# Altium schematic sheet pca63100_power_supply.SchDoc: Power Profiler Kit II
size A3; Organization: Nordic Semiconductor; Revision: 1.0.1; SheetNumber: 3; SheetTotal: 6; CompanyName: Nordic Semiconductor; DocumentSize: A3
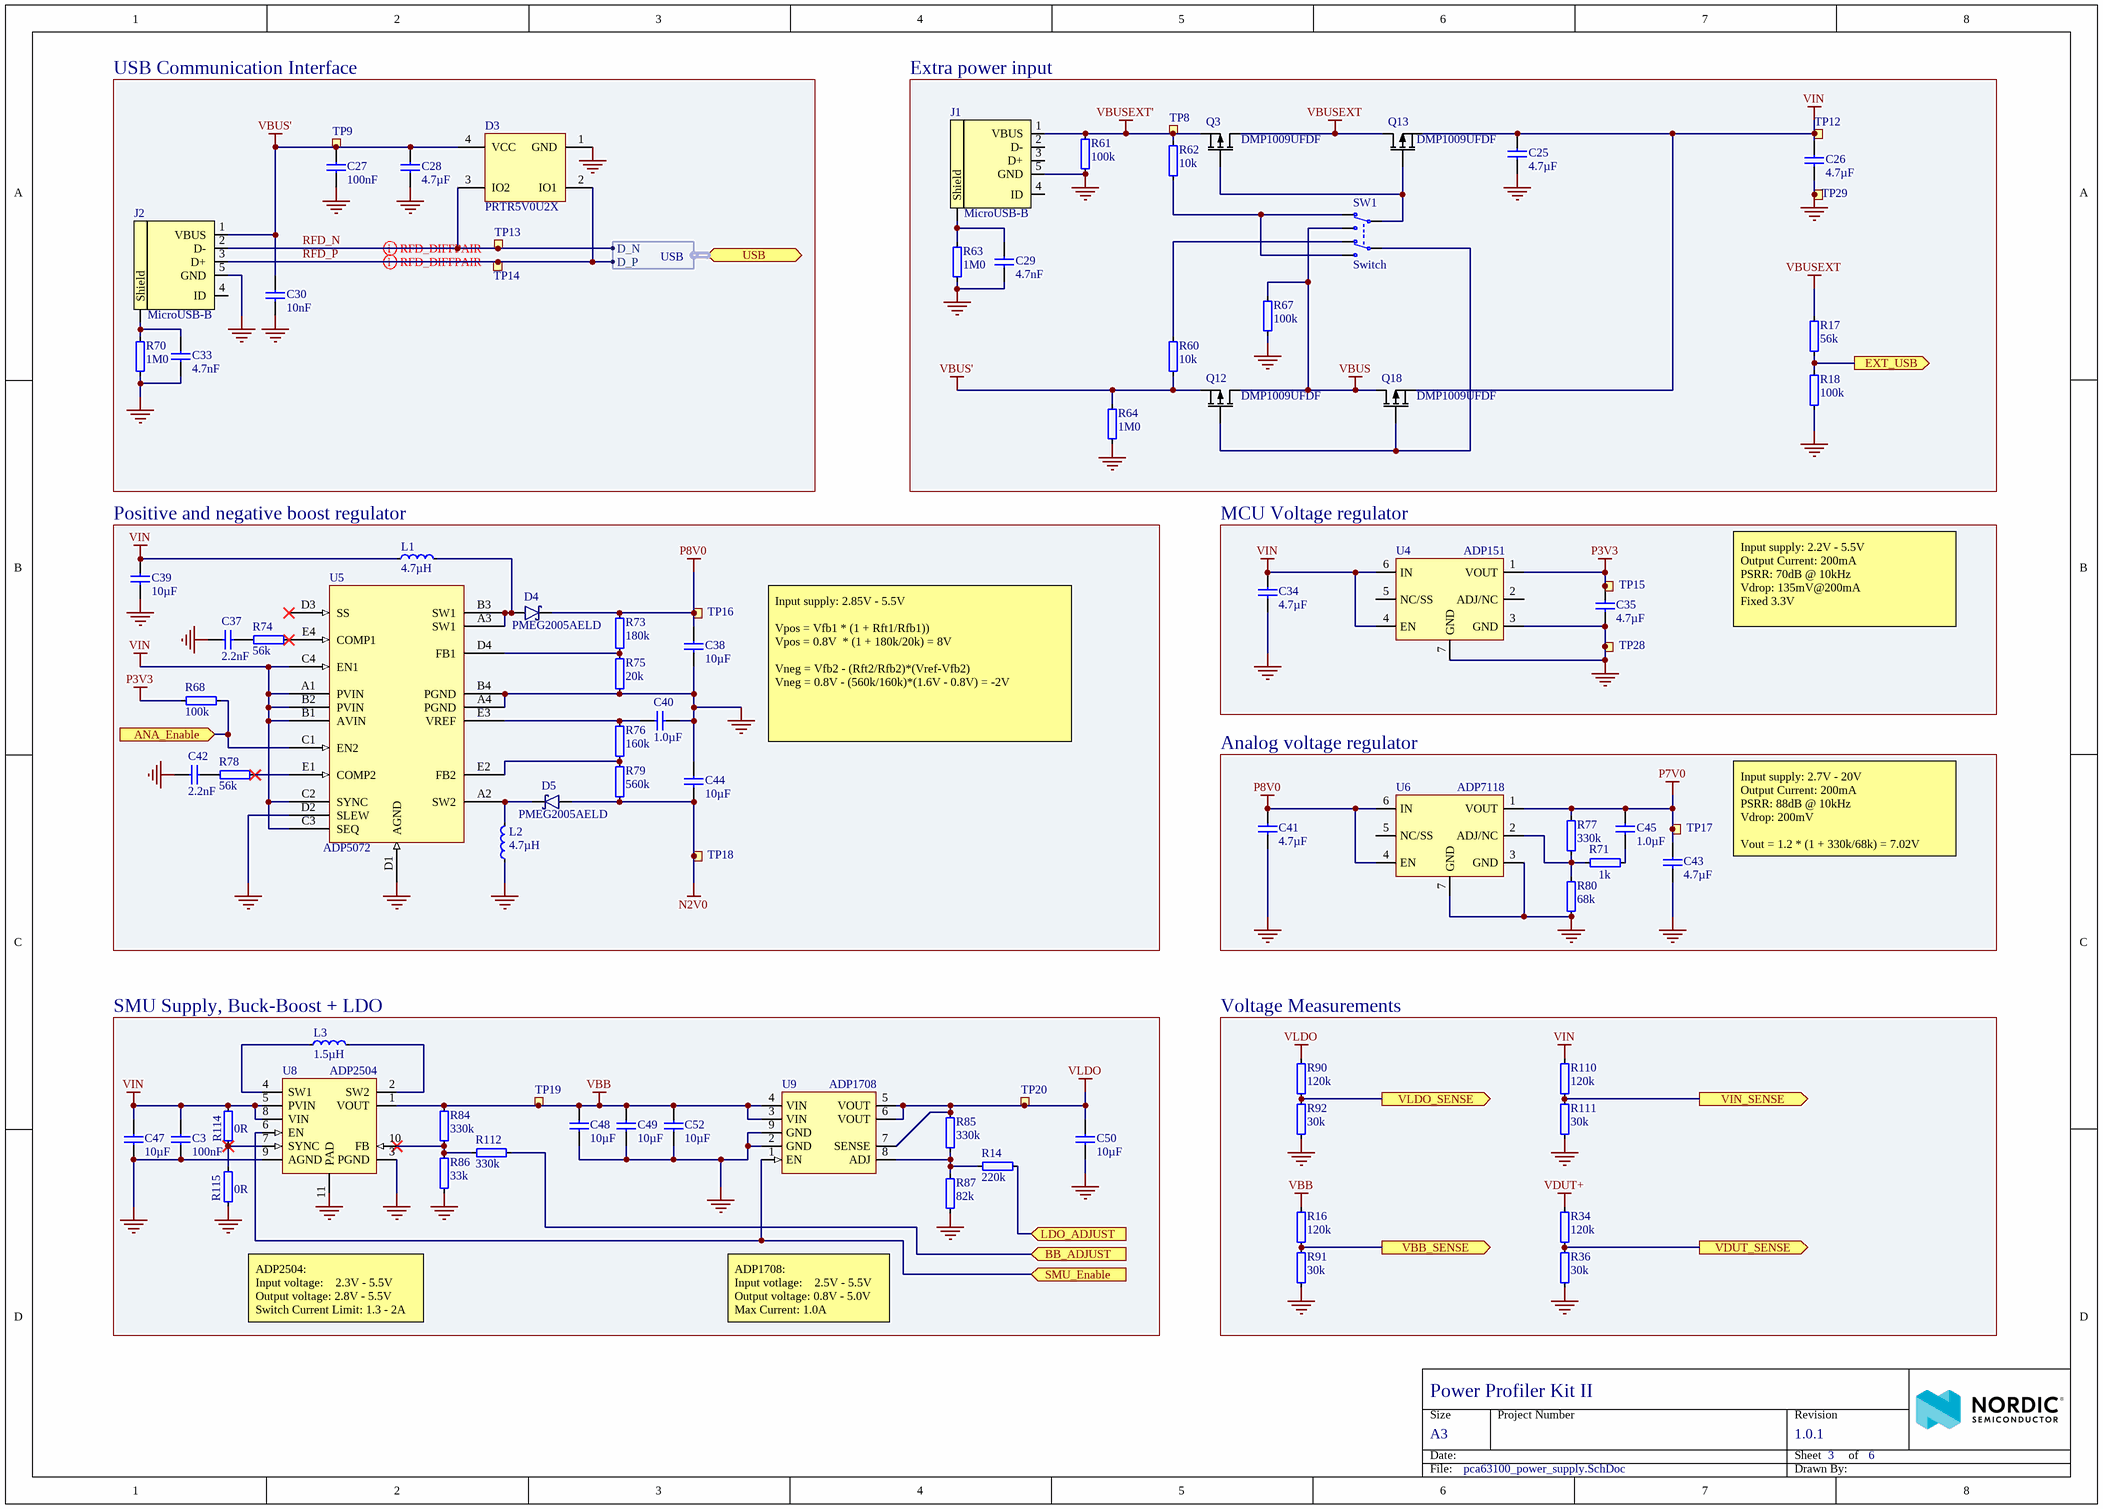
[diagram p0: pca63100_power_supply.SchDoc]

## Parts
C3  100nF  [CAPC0603X03L_C]
C25  4.7µF  [CAPC1005X04L]
C26  4.7µF  [CAPC1005X04L]
C27  100nF  [CAPC0603X03L_C]
C28  4.7µF  [CAPC1005X04L]
C29  4.7nF  [CAPC0603X03L_C]
C30  10nF  [CAPC0603X03L_C]
C33  4.7nF  [CAPC0603X03L_C]
C34  4.7µF  [CAPC1005X04L]
C35  4.7µF  [CAPC1005X04L]
C37  2.2nF  [CAPC0603X03L_C]
C38  10µF  [CAPC1608X06L]
C39  10µF  [CAPC1608X06L]
C40  1.0µF  [CAPC1005X04L]
C41  4.7µF  [CAPC1005X04L]
C42  2.2nF  [CAPC0603X03L_C]
C43  4.7µF  [CAPC1005X04L]
C44  10µF  [CAPC1608X06L]
C45  1.0µF  [CAPC0603X03L_C]
C47  10µF  [CAPC1608X06L]
C48  10µF  [CAPC1608X06L]
C49  10µF  [CAPC1608X06L]
C50  10µF  [CAPC1608X06L]
C52  10µF  [CAPC1608X06L]
D3  PRTR5V0U2X  [SOT190P230X110-4L]
D4  PMEG2005AELD  [DFN1006D-2]
D5  PMEG2005AELD  [DFN1006D-2]
J1  MicroUSB-B  [USB-Micro-B-RA-SMD-PiP]
J2  MicroUSB-B  [USB-Micro-B-RA-SMD-PiP]
L1  4.7µH  [IND_EPL2014]
L2  4.7µH  [IND_EPL2014]
L3  1.5µH  [TY-NR3015]
Q3  DMP1009UFDF  [UDFN65P200X200X60_HS-6N]
Q12  DMP1009UFDF  [UDFN65P200X200X60_HS-6N]
Q13  DMP1009UFDF  [UDFN65P200X200X60_HS-6N]
Q18  DMP1009UFDF  [UDFN65P200X200X60_HS-6N]
R14  220k  [RESC0603X03L_C]
R16  120k  [RESC0603X03L_C]
R17  56k  [RESC0603X03L_C]
R18  100k  [RESC0603X03L_C]
R34  120k  [RESC0603X03L_C]
R36  30k  [RESC0603X03L_C]
R60  10k  [RESC0603X03L_C]
R61  100k  [RESC0603X03L_C]
R62  10k  [RESC0603X03L_C]
R63  1M0  [RESC0603X03L_C]
R64  1M0  [RESC0603X03L_C]
R67  100k  [RESC0603X03L_C]
R68  100k  [RESC0603X03L_C]
R70  1M0  [RESC0603X03L_C]
R71  1k  [RESC0603X03L_C]
R73  180k  [RESC0603X03L_C]
R74  56k  [RESC0603X03L_C]
R75  20k  [RESC0603X03L_C]
R76  160k  [RESC1005X04L]
R77  330k  [RESC0603X03L_C]
R78  56k  [RESC0603X03L_C]
R79  560k  [RESC0603X03L_C]
R80  68k  [RESC0603X03L_C]
R84  330k  [RESC0603X03L_C]
R85  330k  [RESC0603X03L_C]
R86  33k  [RESC0603X03L_C]
R87  82k  [RESC0603X03L_C]
R90  120k  [RESC0603X03L_C]
R91  30k  [RESC0603X03L_C]
R92  30k  [RESC0603X03L_C]
R110  120k  [RESC0603X03L_C]
R111  30k  [RESC0603X03L_C]
R112  330k  [RESC0603X03L_C]
R114  0R  [RESC0603X03L_C]
R115  0R  [RESC0603X03L_C]
SW1  Switch  [Switch-Slide-RA-J-Lead-DPDT-8.5x3.5mm]
TP8  Ø1.5mm,SMD  [TP_SMD_Ø1.5mm]  (value not drawn)  (no BOM)
TP9  Ø1.5mm,SMD  [TP_SMD_Ø1.5mm]  (value not drawn)  (no BOM)
TP12  Ø1.5mm,SMD  [TP_SMD_Ø1.5mm]  (value not drawn)  (no BOM)
TP13  Ø1.5mm,SMD  [TP_SMD_Ø1.5mm]  (value not drawn)  (no BOM)
TP14  Ø1.5mm,SMD  [TP_SMD_Ø1.5mm]  (value not drawn)  (no BOM)
TP15  Ø1.5mm,SMD  [TP_SMD_Ø1.5mm]  (value not drawn)  (no BOM)
TP16  Ø1.5mm,SMD  [TP_SMD_Ø1.5mm]  (value not drawn)  (no BOM)
TP17  Ø1.5mm,SMD  [TP_SMD_Ø1.5mm]  (value not drawn)  (no BOM)
TP18  Ø0.7mm,SMD  [TP_SMD_Ø0.7mm]  (value not drawn)  (no BOM)
TP19  Ø0.7mm,SMD  [TP_SMD_Ø0.7mm]  (value not drawn)  (no BOM)
TP20  Ø1.5mm,SMD  [TP_SMD_Ø1.5mm]  (value not drawn)  (no BOM)
TP28  Ø1.5mm,SMD  [TP_SMD_Ø1.5mm]  (value not drawn)  (no BOM)
TP29  Ø1.5mm,SMD  [TP_SMD_Ø1.5mm]  (value not drawn)  (no BOM)
U4  ADP151  [SON65P200X60_HS-7N]
U5  ADP5072  [BGA20C40P4X5_161X218X56]
U6  ADP7118  [SON65P200X60_HS-7N]
U8  ADP2504  [SON50P300X80-HS-11N]
U9  ADP1708  [SON50P300X80_HS-9N]

## Blocks framed on the sheet
USB Communication Interface: C27 C28 C30 C33 D3 J2 R70 TP9 TP13 TP14
Extra power input: C25 C26 C29 J1 Q3 Q12 Q13 Q18 R17 R18 R60-R64 R67 SW1 TP8 TP12 TP29
Positive and negative boost regulator: C37-C40 C42 C44 D4 D5 L1 L2 R68 R73-R76 R78 R79 TP16 TP18 U5
MCU Voltage regulator: C34 C35 TP15 TP28 U4
Analog voltage regulator: C41 C43 C45 R71 R77 R80 TP17 U6
SMU Supply, Buck-Boost + LDO: C3 C47-C50 C52 L3 R14 R84-R87 R112 R114 R115 TP19 TP20 U8 U9
Voltage Measurements: R16 R34 R36 R90-R92 R110 R111

## Ports
ANA_Enable (in), BB_ADJUST (in), EXT_USB (out), LDO_ADJUST (in), SMU_Enable (in), USB (bidir, harness USB), VBB_SENSE (out), VDUT_SENSE (out), VIN_SENSE (out), VLDO_SENSE (out)

## Harnesses
USB: D_N, D_P

## Nets
GND: C3.2 C25.1 C26.1 C27.2 C28.2 C29.2 C30.2 C33.2 C34.2 C35.1 C37.1 C38.1 C39.2 C40.1 C41.2 C42.1 C43.1 C44.1 C47.2 C48.2 C49.2 C50.2 C52.2 D3.1(GND) J1.5(GND) J2.5(GND) L2.1 R18.1 R36.1 R61.2 R63.2 R64.2 R67.2 R70.2 R75.1 R80.1 R86.1 R87.1 R91.1 R92.1 R111.1 R115.1 TP28.1 TP29.1 U4.3(GND) U4.7(GND) U5.A4(PGND) U5.B4(PGND) U5.D1(AGND) U5.D2(SLEW) U6.3(GND) U6.7(GND) U8.3(PGND) U8.9(AGND) U8.11(PAD) U9.2(GND) U9.9(GND)
N2V0: C44.2 D5.2(A) R79.1 TP18.1
P3V3: C35.2 R68.1 TP15.1 U4.1(VOUT)
P7V0: C43.2 C45.2 R77.2 TP17.1 U6.1(VOUT)
P8V0: C38.2 C41.1 D4.1(C) R73.2 TP16.1 U6.4(EN) U6.6(IN)
VBB: C48.1 C49.1 C52.1 R16.2 R84.2 TP19.1 U8.1(VOUT) U9.3(VIN) U9.4(VIN)
VBUS: Q12.3(D) Q18.3(D) R67.1 SW1.1(N.O-1)
VBUS': C27.1 C28.1 C30.1 D3.4(VCC) J2.1(VBUS) Q12.2(S) R60.2 R64.1 TP9.1
VBUSEXT: Q3.3(D) Q13.3(D) R17.1
VBUSEXT': J1.1(VBUS) Q3.2(S) R61.1 R62.1 TP8.1
VDUT+: R34.2
VIN: C3.1 C25.2 C26.2 C34.1 C39.1 C47.1 L1.1 Q13.2(S) Q18.2(S) R110.2 R114.2 TP12.1 U4.4(EN) U4.6(IN) U5.A1(PVIN) U5.B1(AVIN) U5.B2(PVIN) U5.C2(SYNC) U5.C3(SEQ) U5.C4(EN1) U8.5(PVIN) U8.8(VIN)
VLDO: C50.1 R85.2 R90.2 TP20.1 U9.5(VOUT) U9.6(VOUT) U9.7(SENSE)
ANA_Enable: R68.2 U5.C1(EN2) ; port ANA_Enable
BB_ADJUST: R112.2 ; port BB_ADJUST
EXT_USB: R17.2 R18.2 ; port EXT_USB
LDO_ADJUST: R14.2 ; port LDO_ADJUST
RFD_N: D3.3(IO2) J2.2(D-) TP13.1 ; port USB.D_N
RFD_P: D3.2(IO1) J2.3(D+) TP14.1 ; port USB.D_P
SMU_Enable: U8.6(EN) U9.1(EN) ; port SMU_Enable
VBB_SENSE: R16.1 R91.2 ; port VBB_SENSE
VDUT_SENSE: R34.1 R36.2 ; port VDUT_SENSE
VIN_SENSE: R110.1 R111.2 ; port VIN_SENSE
VLDO_SENSE: R90.1 R92.2 ; port VLDO_SENSE
NetC29_1: C29.1 J1.6(Shield) R63.1
NetC33_1: C33.1 J2.6(Shield) R70.1
NetC37_2: C37.2 R74.1
NetC40_2: C40.2 R76.2 U5.E3(VREF)
NetC42_2: C42.2 R78.1
NetC45_1: C45.1 R71.1
NetD4_2: D4.2(A) L1.2 U5.A3(SW1) U5.B3(SW1)
NetD5_1: D5.1(C) L2.2 U5.A2(SW2)
NetL3_1: L3.1 U8.4(SW1)
NetL3_2: L3.2 U8.2(SW2)
NetQ3_1: Q3.1(G) Q13.1(G) SW1.2(COM-1)
NetQ12_1: Q12.1(G) Q18.1(G) SW1.5(COM-2)
NetR14_1: R14.1 R85.1 R87.2 U9.8(ADJ)
NetR60_1: R60.1 SW1.6(N.C-2)
NetR62_2: R62.2 SW1.3(N.C-1) SW1.4(N.O-2)
NetR71_2: R71.2 R77.1 R80.2 U6.2(ADJ/NC)
NetR73_1: R73.1 R75.2 U5.D4(FB1)
NetR74_2: R74.2 U5.E4(COMP1)
NetR76_1: R76.1 R79.2 U5.E2(FB2)
NetR78_2: R78.2 U5.E1(COMP2)
NetR84_1: R84.1 R86.2 R112.1 U8.10(FB)
NetR114_1: R114.1 R115.2 U8.7(SYNC)

Not connected (* = marked no-connect by the designer): J1 2(D-) 3(D+) 4(ID); J2 4(ID); U4 2(ADJ/NC) 5(NC/SS); U5 D3(SS)*; U6 5(NC/SS)

## Layout directives
differential pair; differential pair class USB2: RFD_N, RFD_P

## Notes on the sheet
- Input supply: 2.2V - 5.5V
  Output Current: 200mA
  PSRR: 70dB @ 10kHz
  Vdrop: 135mV@200mA
  Fixed 3.3V
- Input supply: 2.85V - 5.5V
  Vpos = Vfb1 * (1 + Rft1/Rfb1))
  Vpos = 0.8V  * (1 + 180k/20k) = 8V
  Vneg = Vfb2 - (Rft2/Rfb2)*(Vref-Vfb2)
  Vneg = 0.8V - (560k/160k)*(1.6V - 0.8V) = -2V
- Input supply: 2.7V - 20V
  Output Current: 200mA
  PSRR: 88dB @ 10kHz
  Vdrop: 200mV
  Vout = 1.2 * (1 + 330k/68k) = 7.02V
- ADP2504:
  Input voltage:    2.3V - 5.5V
  Output voltage: 2.8V - 5.5V
  Switch Current Limit: 1.3 - 2A
- ADP1708:
  Input votlage:    2.5V - 5.5V
  Output voltage: 0.8V - 5.0V
  Max Current: 1.0A
- Size
- Date:
- A3
- Project Number
- Sheet         of
- Revision
- File:
- Drawn By:

## Library data of the parts
C3 C27 = C0201-100n: Capacitor, X5R, ±10%; Part number IPS: 00000001248, 00000002505; Note: 16V; Artikkelnr Noca: N.A.; Pad Count: 2; Part Number: C0201-100n; LatestRevisionDate: 2017-11-09; Pin Count: 2; Publisher: Nordic Semiconductor; Published: 2014-11-13; Value: 100nF; Footprint Doc: 0201; ComponentLink1Description: Datasheet; ComponentLink2Description: Supplier link; Component Class: Capacitors; PartId: 100200078
C25 C26 C28 C34 C35 C41 C43 = C0402-4µ7: Capacitor, X5R, ±20%; Part number IPS: 00000001251, 00000007165; Note: 10V; Artikkelnr Noca: 20039482; Pad Count: 2; Part Number: C0402-4µ7; ComponentLink1Description: Datasheet; ComponentLink2Description: Supplier link; Footprint Doc: 0402; LatestRevisionDate: 2017-11-09; Pin Count: 2; Publisher: Nordic Semiconductor; Published: 2009-05-08; Value: 4.7µF; Supplier 1: Digi-Key; Supplier Part Number 1: 490-13252-1-ND; Component Class: Capacitors; PartId: 100200193
C29 C33 = C0201-4n7: Chip Cap 0201; Part number IPS: 00000001243; Note: Chip Cap 1%; Artikkelnr Noca: N.A.; Pad Count: 2; Part Number: C0201-4n7; LatestRevisionDate: 2020-10-13; Pin Count: 2; Publisher: Nordic Semiconductor; Published: 2014-11-13; Value: 4.7nF; Footprint Doc: 0201; ComponentLink1Description: Datasheet; ComponentLink2Description: Supplier link; Component Class: Capacitors; PartId: 100200063
C30 = C0201-10n: Capacitor, X7R, ±10%; Part number IPS: 00000003480; Note: 10V; Artikkelnr Noca: N.A.; Pad Count: 2; Part Number: C0201-10n; LatestRevisionDate: 2017-11-09; Pin Count: 2; Publisher: Nordic Semiconductor; Published: 2014-11-13; Value: 10nF; ComponentLink1Description: Datasheet; ComponentLink2Description: Supplier link; Footprint Doc: 0201; Component Class: Capacitors; PartId: 100200067
C37 C42 = C0201-2n2: Capacitor, X7R, ±10%, 10V; Part number IPS: 00000001778; Artikkelnr Noca: N.A.; Pad Count: 2; Part Number: C0201-2n2; ComponentLink1Description: Datasheet; ComponentLink2Description: Supplier link; Footprint Doc: 0201; LatestRevisionDate: 2014-11-13; Pin Count: 2; Publisher: Nordic Semiconductor; Published: 2014-11-13; Value: 2.2nF; Note: 10V; Component Class: Capacitors; PartId: 100200060
C38 C39 C44 C47-C50 C52 = 0603-10u-10V-X7T-GRM188: CAP CER 10UF 10V X7T 0603; Manufacturer: Murata; Manufacturer Part Number: GRM188D71A106MA73; Part number IPS: 00000004696; Note: 10VDC; Artikkelnr Noca: N.A; Pad Count: 2; Part Number: 0603-10u-10V-X7T-GRM188; ComponentLink1Description: Datasheet; ComponentLink2Description: Supplier link; HelpURL: https://no.mouser.com/datasheet/2/281/murata_03052018_GRM_Series_1-1310166.pdf; Footprint Doc: 0603; LatestRevisionDate: 2020-10-13; Pin Count: 2; Publisher: Nordic Semiconductor; Published: 2018-09-11; Value: 10µF; Supplier 1: Digi-Key; Supplier Part Number 1: 490-7200-1-ND; Supplier 2: Mouser; Supplier Part Number 2: 81-GRM188D71A106MA3D; Component Class: Capacitors; PartId: 100200414
C40 = C0402-1µ0: Capacitor, X5R, ±5%, 6.3V; Part number IPS: 00000007786, 00000003457; Artikkelnr Noca: 20039235; Pad Count: 2; Part Number: C0402-1µ0; ComponentLink1Description: Datasheet; ComponentLink2Description: Supplier link; Footprint Doc: 0402; LatestRevisionDate: 2016-08-22; Pin Count: 2; Publisher: Nordic Semiconductor; Published: 2009-05-08; Value: 1.0µF; Note: 6.3V; Supplier 1: Digi-Key; Supplier Part Number 1: 1276-1444-1-ND; Component Class: Capacitors; PartId: 100200190
C45 = C0201-1µ0: Capacitor, X5R, ±10%; Part number IPS: 00000001723; Note: 10V; Artikkelnr Noca: N.A.; Pad Count: 2; Part Number: C0201-1µ0; ComponentLink1Description: Datasheet; ComponentLink2Description: Supplier link; Footprint Doc: 0201; LatestRevisionDate: 2016-08-22; Pin Count: 2; Publisher: Nordic Semiconductor; Published: 2009-05-08; Value: 1.0µF; Supplier 1: Digi-Key; Supplier Part Number 1: 1276-6795-1-ND; Component Class: Capacitors; PartId: 100200084
D3 = PRTR5V0U2X: Ultra low capacitance double rail-to-rail ESD protection diode; Manufacturer: NXP; Part number IPS: 00000009951; Artikkelnr Noca: 10069015; Pad Count: 4; Part Number: PRTR5V0U2X; Manufacturer Part Number: PRTR5V0U2X; LatestRevisionDate: 2017-11-09; Publisher: Nordic Semiconductor; Published: 2012-06-11; Value: PRTR5V0U2X; Footprint Doc: SOT-143B; Pin Count: 4; ComponentLink1Description: Datasheet; ComponentLink2Description: Supplier link; HelpURL: http://www.farnell.com/datasheets/109718.pdf; Supplier 1: Digi-Key; Supplier Part Number 1: 568-4140-1-ND; Supplier 2: Farnell; Supplier Part Number 2: 152-4157; Component Class: Semiconductors; PartId: 101300082
D4 D5 = PMEG2005AELD: DIODE SCHOTTKY 20V 0.5A DFN1006D-2/SOD882D; Manufacturer: NXP; Manufacturer Part Number: PMEG2005AELD, 315; Part number IPS: 00000004695; Artikkelnr Noca: N.A.; Pad Count: 2; Part Number: PMEG2005AELD; ComponentLink1URL: https://assets.nexperia.com/documents/data-sheet/PMEG2005AELD.pdf; ComponentLink1Description: Datasheet; ComponentLink2URL: https://no.mouser.com/ProductDetail/Nexperia/PMEG2005AELD315?qs=%2Fha2pyFadujeRJ0LUdYAUYd%2FhKYkfcTYConG%2FJJ6i55M7Nxw9Mi4%2Fw%3D%3D; ComponentLink2Description: Supplier link; HelpURL: https://www.nexperia.com/products/diodes/schottky-diodes-and-rectifiers/schottky-diodes-and-rectifiers-if-1-a/PMEG2005AELD.html; Footprint Doc: DFN1006D-2; LatestRevisionDate: 2019-10-02; Pin Count: 2; Publisher: Nordic Semiconductor; Published: 2019-10-02; Value: PMEG2005AELD; Supplier 1: Farnell; Supplier Part Number 1: 197-2709; Supplier 2: Mouser; Supplier Part Number 2: 771-PMEG2005AELD315; Component Class: Semiconductors; PartId: 101300169
J1 J2 = USB-Micro-B-RA-SMD-PiP: MicroUSB-B-SMT; Manufacturer: Allen Creations Corp.; Manufacturer Part Number: AJU55-BS2111-L; 2nd source part number: 609-4616-1-ND; Part number IPS: 00000007790; Artikkelnr Noca: 55029020; Artikkelnr Simpro: N.A.; Pad Count: 5; Part Number: USB-Micro-B-RA-SMD-PiP; Footprint Doc: USB-Micro-B-RA-SMD-PiP; LatestRevisionDate: 2016-04-21; Pin Count: 5; Publisher: Nordic Semiconductor; Published: 2014-10-07; Value: MicroUSB-B; Supplier: Cabcon; Supplier part number: AJU55-BS2111-L; 2nd source Supplier: Digi-Key; ComponentLink1Description: Datasheet; ComponentLink2Description: Supplier link; HelpURL: \\hizz\pro\app9717\Datasheet\connectors\Allen Creations Corp\AJU-211.pdf; Supplier 1: Cabcon; Supplier 2: Digi-Key; Supplier Part Number 1: AJU55-BS2111-L; Supplier Part Number 2: 609-4616-1-ND; Component Class: Connectors; PartId: 100500490
L1 L2 = EPL2014-472MLC: Shielded Power Inductor EPL2014 Low DCR Ind 4.7 uH 20 % 650mA; Manufacturer: Coilcraft; Part number IPS: 00000004697; Artikkelnr Noca: N.A.; Pad Count: 2; Part Number: EPL2014-472MLC; Manufacturer Part Number: EPL2014-472MLC; ComponentLink1Description: Datasheet; ComponentLink2Description: Supplier link; HelpURL: https://no.mouser.com/datasheet/2/597/epl2014-270728.pdf; Footprint Doc: IND_EPL2014; LatestRevisionDate: 2020-01-07; Pin Count: 2; Publisher: Nordic Semiconductor; Published: 2019-06-21; Value: 4.7µH; Supplier 1: Mouser; Supplier Part Number 1: 994-EPL2014-472MLB; Component Class: Inductors; PartId: 100300390
L3 = NR3015-1µ5-1.8A-48mOhm: Ferrite Inductor, Shielded, 1,8A, 48mOhm; Manufacturer: Taiyo Yuden; Manufacturer Part Number: NR3015T1R5N; Part number IPS: 00000004698; Artikkelnr Noca: N.A.; Pad Count: 2; Part Number: NR3015-1µ5-1.8A-48mOhm; ComponentLink1Description: Datasheet; ComponentLink2Description: Supplier link; HelpURL: https://ds.yuden.co.jp/TYCOMPAS/ut/specSheet?pn=NR3015T1R5N; Footprint Doc: 1212; LatestRevisionDate: 2019-10-01; Pin Count: 2; Publisher: Nordic Semiconductor; Published: 2019-10-01; Value: 1.5µH; Supplier 1: Digi-Key; Supplier Part Number 1: 587-2617-1-ND; Supplier 2: Farnell; Supplier Part Number 2: 208-4899; Component Class: Inductors; PartId: 100300391
Q3 Q12 Q13 Q18 = DMP1009UFDF: P Ch MOFET, 11A, 30mOhm max, 2W; Manufacturer: Diodes Incorporated; Part number IPS: 00000004784; Artikkelnr Noca: N.A.; Pad Count: 6; Part Number: DMP1009UFDF; Manufacturer Part Number: DMP1009UFDF; ComponentLink1URL: https://www.diodes.com/assets/Datasheets/DMP1009UFDF.pdf; ComponentLink1Description: Datasheet; ComponentLink2Description: Supplier link; Footprint Doc: UDFN-6; LatestRevisionDate: 2019-02-12; Pin Count: 6; Publisher: Nordic Semiconductor; Published: 2019-02-12; Value: DMP1009UFDF; Supplier 1: Digi-Key; Supplier Part Number 1: DMP1009UFDF-7DICT-ND; Component Class: Semiconductors; PartId: 101300164
R14 = R0201-220k: Resistor, ±1%, 0.05W; Part number IPS: 00000004789; Note: Chip Res 1%; Artikkelnr Noca: N.A.; Pad Count: 2; Part Number: R0201-220k; LatestRevisionDate: 2014-11-13; Pin Count: 2; Publisher: Nordic Semiconductor; Published: 2014-11-13; Value: 220k; Footprint Doc: 0201; ComponentLink1Description: Datasheet; ComponentLink2Description: Supplier link; Component Class: Resistors; PartId: 100100084
R16 R34 R90 R110 = R0201-120k: Resistor, ±1%, 0.05W; Part number IPS: 00000001425; Note: Chip Res 1%; Artikkelnr Noca: N.A.; Pad Count: 2; Part Number: R0201-120k; ComponentLink1Description: Datasheet; ComponentLink2Description: Supplier link; Footprint Doc: 0201; LatestRevisionDate: 2014-11-13; Pin Count: 2; Publisher: Nordic Semiconductor; Published: 2014-11-13; Value: 120k; Component Class: Resistors; PartId: 100100081
R17 R74 R78 = R0201-56k: Resistor, ±1%, 0.05W; Part number IPS: 00000007882; Note: Chip Res 1%; Artikkelnr Noca: N.A.; Pad Count: 2; Part Number: R0201-56k; LatestRevisionDate: 2014-11-13; Pin Count: 2; Publisher: Nordic Semiconductor; Published: 2014-11-13; Value: 56k; Footprint Doc: 0201; ComponentLink1Description: Datasheet; ComponentLink2Description: Supplier link; Component Class: Resistors; PartId: 100100077
R18 R61 R67 R68 = R0201-100k: Resistor, ±1%, 0.05W; Part number IPS: 00000001419; Note: Chip Res 1%; Artikkelnr Noca: N.A.; Pad Count: 2; Part Number: R0201-100k; Footprint Doc: 0201; LatestRevisionDate: 2014-11-13; Pin Count: 2; Publisher: Nordic Semiconductor; Published: 2014-11-13; Value: 100k; ComponentLink1Description: Datasheet; ComponentLink2Description: Supplier link; Component Class: Resistors; PartId: 100100080
R36 R91 R92 R111 = R0201-30k: Resistor, ±1%, 0.05W; Part number IPS: 00000004318; Note: Chip Res 1%; Artikkelnr Noca: N.A.; Pad Count: 2; Part Number: R0201-30k; ComponentLink1Description: Datasheet; ComponentLink2Description: Supplier link; Footprint Doc: 0201; LatestRevisionDate: 2016-04-20; Pin Count: 2; Publisher: Nordic Semiconductor; Published: 2016-04-20; Value: 30k; Component Class: Resistors; PartId: 100100564
R60 R62 = R0201-10k_0.1%: Resistor, ±0.1%, 0.031W; Part number IPS: 00000004786; Note: Chip Res 0.1%; Artikkelnr Noca: N.A.; Pad Count: 2; Part Number: R0201-10k_0.1%; ComponentLink1Description: Datasheet; ComponentLink2Description: Supplier link; Footprint Doc: 0201; LatestRevisionDate: 2019-10-07; Pin Count: 2; Publisher: Nordic Semiconductor; Published: 2019-10-07; Value: 10k; Component Class: Resistors; PartId: 100100597
R63 R64 R70 = R0201-1M0: Resistor, ±1%, 0.05W; Part number IPS: 00000001418; Note: Chip Res 1%; Artikkelnr Noca: N.A.; Pad Count: 2; Value: 1M0; Part Number: R0201-1M0; LatestRevisionDate: 2014-11-13; Pin Count: 2; Publisher: Nordic Semiconductor; Published: 2014-11-13; Footprint Doc: 0201; ComponentLink1Description: Datasheet; ComponentLink2Description: Supplier link; Component Class: Resistors; PartId: 100100093
R71 = R0201-1k0: Resistor, ±1%, 0.05W; Part number IPS: 00000005786; Note: Chip Res 1%; Artikkelnr Noca: N.A.; Pad Count: 2; Part Number: R0201-1k0; ComponentLink1Description: Datasheet; ComponentLink2Description: Supplier link; Footprint Doc: 0201; LatestRevisionDate: 2014-11-13; Pin Count: 2; Publisher: Nordic Semiconductor; Published: 2014-11-13; Value: 1k; Component Class: Resistors; PartId: 100100043
R73 = R0201-180k: Resistor, ±1%, 0.05W; Part number IPS: 00000004797; Note: Chip Res 1%; Artikkelnr Noca: N.A.; Pad Count: 2; Part Number: R0201-180k; ComponentLink1Description: Datasheet; ComponentLink2Description: Supplier link; Footprint Doc: 0201; LatestRevisionDate: 2014-11-13; Pin Count: 2; Publisher: Nordic Semiconductor; Published: 2014-11-13; Value: 180k; Component Class: Resistors; PartId: 100100083
R75 = R0201-20k_0.1%: Resistor, ±0.1%, 0.031W; Part number IPS: 00000004785; Note: Chip Res 0.1%; Artikkelnr Noca: N.A.; Pad Count: 2; Part Number: R0201-20k_0.1%; ComponentLink1Description: Datasheet; ComponentLink2Description: Supplier link; Footprint Doc: 0201; LatestRevisionDate: 2019-10-07; Pin Count: 2; Publisher: Nordic Semiconductor; Published: 2019-10-07; Value: 20k; Component Class: Resistors; PartId: 100100598
R76 = R0402-160k_0.1%: Resistor, ±0.1%, 0.063W; Part number IPS: 00000004798; Note: Chip Res 0.1%; Artikkelnr Noca: N.A.; Pad Count: 2; Part Number: R0402-160k_0.1%; ComponentLink1Description: Datasheet; ComponentLink2Description: Supplier link; Footprint Doc: 0402; LatestRevisionDate: 2016-03-30; Pin Count: 2; Publisher: Nordic Semiconductor; Published: 2016-03-30; Value: 160k; Supplier 1: Digi-key; Supplier Part Number 1: A119926CT-ND; Component Class: Resistors; PartId: 100100247
R77 R84 R85 R112 = R0201-330k: Resistor, ±1%, 0.05W; Part number IPS: 00000001424; Note: Chip Res 1%; Artikkelnr Noca: N.A.; Pad Count: 2; Part Number: R0201-330k; ComponentLink1Description: Datasheet; ComponentLink2Description: Supplier link; Footprint Doc: 0201; LatestRevisionDate: 2014-11-13; Pin Count: 2; Publisher: Nordic Semiconductor; Published: 2014-11-13; Value: 330k; Component Class: Resistors; PartId: 100100087
R79 = R0201-560k: Resistor, ±1%, 0.05W; Part number IPS: 00000004799; Note: Chip Res 1%; Artikkelnr Noca: N.A.; Pad Count: 2; Part Number: R0201-560k; ComponentLink1Description: Datasheet; ComponentLink2Description: Supplier link; Footprint Doc: 0201; LatestRevisionDate: 2014-11-13; Pin Count: 2; Publisher: Nordic Semiconductor; Published: 2014-11-13; Value: 560k; Component Class: Resistors; PartId: 100100090
R80 = R0201-68k: Resistor, ±1%, 0.05W; Part number IPS: 00000004800; Note: Chip Res 1%; Artikkelnr Noca: N.A.; Pad Count: 2; Part Number: R0201-68k; ComponentLink1Description: Datasheet; ComponentLink2Description: Supplier link; Footprint Doc: 0201; LatestRevisionDate: 2014-11-13; Pin Count: 2; Publisher: Nordic Semiconductor; Published: 2014-11-13; Value: 68k; Component Class: Resistors; PartId: 100100078
R86 = R0201-33k: Resistor, ±1%, 0.05W; Part number IPS: 00000001708; Note: Chip Res 1%; Artikkelnr Noca: N.A.; Pad Count: 2; Part Number: R0201-33k; LatestRevisionDate: 2014-11-13; Pin Count: 2; Publisher: Nordic Semiconductor; Published: 2014-11-13; Value: 33k; Footprint Doc: 0201; ComponentLink1Description: Datasheet; ComponentLink2Description: Supplier link; Component Class: Resistors; PartId: 100100073
R87 = R0201-82k: Resistor, ±1%, 0.05W; Part number IPS: 00000004801; Note: Chip Res 1%; Artikkelnr Noca: N.A.; Pad Count: 2; Part Number: R0201-82k; LatestRevisionDate: 2014-11-13; Pin Count: 2; Publisher: Nordic Semiconductor; Published: 2014-11-13; Value: 82k; Footprint Doc: 0201; ComponentLink1Description: Datasheet; ComponentLink2Description: Supplier link; Component Class: Resistors; PartId: 100100079
R114 R115 = R0201-0R: Resistor, ±5%, 0.05W; Part number IPS: 00000003245; Note: Chip Res 5%; Artikkelnr Noca: N.A.; Pad Count: 2; Part Number: R0201-0R; LatestRevisionDate: 2017-11-09; Pin Count: 2; Publisher: Nordic Semiconductor; Published: 2014-11-13; Value: 0R; Footprint Doc: 0201; ComponentLink1Description: Datasheet; ComponentLink2Description: Supplier link; Component Class: Resistors; PartId: 100100001
SW1 = Switch-Slide-RA-J-Lead-DPDT-8.5x3.5mm_Copal: SMD slide Switch (ON-ON); Manufacturer: Copal Electronics Inc; Manufacturer Part Number: CL-SB-22A-11T; Part number IPS: 00000007811; Artikkelnr Noca: N.A.; Pad Count: 6; Part Number: Switch-Slide-RA-J-Lead-DPDT-8.5x3.5mm_Copal; Footprint Doc: Switch-Slide-RA-J-Lead-DPDT-8.5x3.5mm; LatestRevisionDate: 2017-02-01; Pin Count: 6; Publisher: Nordic Semiconductor; Published: 2017-02-01; Value: Switch; ComponentLink1Description: Datasheet; ComponentLink2Description: Supplier link; HelpURL: http://www.nidec-copal-electronics.com/e/catalog/switch/cl-sb.pdf; Supplier 1: Digi-Key; Supplier Part Number 1: 563-1340-1-ND; Supplier 2: Avnet; Supplier Part Number 2: CL-SB-22A-11T; Component Class: Switches; PartId: 101500038
TP8 TP9 TP12-TP17 TP20 TP28 TP29 = TP_SMD_Ø1.5MM: 1.5mm circular SMD testpad; Manufacturer: Nordic Semiconductor; Artikkelnr Noca: N.A.; Pad Count: 1; Part Number: TP_SMD_Ø1.5MM; ComponentLink1Description: Datasheet; ComponentLink2Description: Supplier link; Footprint Doc: TP_SMD_Ø1.5mm; LatestRevisionDate: 2016-06-02; Pin Count: 1; Publisher: Nordic Semiconductor; Published: 2016-06-02; Value: Ø1.5mm,SMD; Part number IPS: N.A.; Component Class: Connectors; PartId: 100500477
TP18 TP19 = TP_SMD_Ø0.7MM: 0.7mm circular SMD testpad; Manufacturer: Nordic Semiconductor; Artikkelnr Noca: N.A.; Pad Count: 1; Part Number: TP_SMD_Ø0.7MM; ComponentLink1Description: Datasheet; ComponentLink2Description: Supplier link; Footprint Doc: TP_SMD_Ø0.7mm; LatestRevisionDate: 2017-12-14; Pin Count: 1; Publisher: Nordic Semiconductor; Published: 2017-12-14; Value: Ø0.7mm,SMD; Part number IPS: N.A.; Component Class: Connectors; PartId: 100500474
U4 = ADP151: Ultralow Noise, 200 mA,CMOS Linear Regulator; Manufacturer: Analog Devices; Manufacturer Part Number: ADP151ACPZ-3.3-R7; Part number IPS: 00000004803; Artikkelnr Noca: N.A.; Pad Count: 7; Part Number: ADP151; ComponentLink1URL: https://www.analog.com/media/en/technical-documentation/data-sheets/ADP151.pdf; ComponentLink1Description: Datasheet; ComponentLink2URL: https://www.digikey.no/product-detail/no/analog-devices-inc/ADP7118ACPZN-R7/ADP7118ACPZN-R7TR-ND/5056887; ComponentLink2Description: Supplier link; HelpURL: https://www.analog.com/en/products/adp151.html; Footprint Doc: UDFN-6; LatestRevisionDate: 2020-02-21; Pin Count: 7; Publisher: Nordic Semiconductor; Published: 2020-02-21; Value: ADP151; Supplier 1: Digi-Key; Supplier Part Number 1: ADP151ACPZ-3.3-R7CT-ND; Supplier 2: Mouser; Supplier Part Number 2: 584-ADP151ACPZ3.3-R7; Component Class: Misc_ICs; PartId: 101900607
U5 = ADP5072: Boost Switching Regulator IC Positive and Negative (Dual Rail) Adjustable 0.8V 2 Output 600mA, 1A 20-UFBGA,; Manufacturer: Analog Devices; Manufacturer Part Number: ADP5072ACBZ-R7; Part number IPS: 00000004804; Artikkelnr Noca: N.A.; Pad Count: 20; Part Number: ADP5072; ComponentLink1URL: https://www.analog.com/media/en/technical-documentation/data-sheets/ADP5072.pdf; ComponentLink1Description: Datasheet; ComponentLink2URL: https://www.digikey.no/product-detail/en/analog-devices-inc/ADP5072ACBZ-R7/ADP5072ACBZ-R7-ND/9990324; ComponentLink2Description: Supplier link; HelpURL: https://www.analog.com/en/products/adp5072.html; Footprint Doc: BGA-20; LatestRevisionDate: 2019-06-20; Pin Count: 20; Publisher: Nordic Semiconductor; Published: 2019-06-20; Value: ADP5072; Supplier 1: Digi-Key; Supplier Part Number 1: ADP5072ACBZ-R7-ND; Supplier 2: Mouser; Supplier Part Number 2: 584-ADP5072ACBZ-R7; Component Class: Misc_ICs; PartId: 101900586
U6 = ADP7118: 20 V, 200 mA, Low Noise,CMOS LDO Linear Regulator; Manufacturer: Analog Devices; Manufacturer Part Number: ADP7118ACPZN-R7; Part number IPS: 00000004964; Artikkelnr Noca: N.A.; Pad Count: 7; Part Number: ADP7118; ComponentLink1URL: https://www.analog.com/media/en/technical-documentation/data-sheets/ADP7118.pdf; ComponentLink1Description: Datasheet; ComponentLink2URL: https://www.digikey.no/product-detail/no/analog-devices-inc/ADP151ACPZ-3.3-R7/ADP151ACPZ-3.3-R7CT-ND/7430437; ComponentLink2Description: Supplier link; HelpURL: https://www.analog.com/en/products/adp7118.html; Footprint Doc: UDFN-6; LatestRevisionDate: 2020-02-21; Pin Count: 7; Publisher: Nordic Semiconductor; Published: 2020-02-21; Value: ADP7118; Supplier 1: Digi-Key; Supplier Part Number 1: ADP7118ACPZN-R7TR-ND; Supplier 2: Mouser; Supplier Part Number 2: 584-ADP7118ACPZN-R7; Component Class: Misc_ICs; PartId: 101900608
U8 = ADP2504: Buck-Boost Switching Regulator IC Positive Adjustable 2.8V 1 Output 1A; Manufacturer: Analog Devices; Manufacturer Part Number: ADP2504ACPZ-R7; Part number IPS: 00000004965; Artikkelnr Noca: N.A.; Pad Count: 10; Part Number: ADP2504; ComponentLink1URL: https://www.analog.com/media/en/technical-documentation/data-sheets/ADP2503_2504.pdf; ComponentLink1Description: Datasheet; ComponentLink2URL: https://www.digikey.com/product-detail/en/analog-devices-inc/ADP2504ACPZ-R7/ADP2504ACPZ-R7CT-ND/2237823; ComponentLink2Description: Supplier link; HelpURL: https://www.analog.com/en/products/adp2504.html; Footprint Doc: LFCSP-10; LatestRevisionDate: 2019-09-25; Pin Count: 10; Publisher: Nordic Semiconductor; Published: 2019-09-25; Value: ADP2504; Supplier 1: Digi-Key; Supplier Part Number 1: ADP2504ACPZ-R7CT-ND; Supplier 2: Mouser; Supplier Part Number 2: 584-ADP2504ACPZ-R7; Component Class: Misc_ICs; PartId: 101900590
U9 = ADP1708: LDO, Adjustable, 1 Output 1A, 8-LFCSP-WD (3x3); Manufacturer: Analog Devices; Manufacturer Part Number: ADP1708ACPZ-R7; Part number IPS: 00000004966; Artikkelnr Noca: N.A.; Pad Count: 9; Part Number: ADP1708; ComponentLink1URL: https://www.analog.com/media/en/technical-documentation/data-sheets/ADP1708.pdf; ComponentLink1Description: Datasheet; ComponentLink2URL: https://www.digikey.no/product-detail/no/analog-devices-inc/ADP1708ACPZ-R7/ADP1708ACPZ-R7CT-ND/2467500; ComponentLink2Description: Supplier link; HelpURL: https://www.analog.com/en/products/adp1708.html; Footprint Doc: UDFN-8; LatestRevisionDate: 2020-02-25; Pin Count: 9; Publisher: Nordic Semiconductor; Published: 2020-02-25; Value: ADP1708; Supplier 1: Digi-Key; Supplier Part Number 1: ADP1708ACPZ-R7CT-ND; Supplier 2: Mouser; Supplier Part Number 2: 584-ADP1708ACPZ-R7; Component Class: Misc_ICs; PartId: 101900609